# EAGLE schematic ee40_robot_final_p1 (EAGLE 6.5.0)
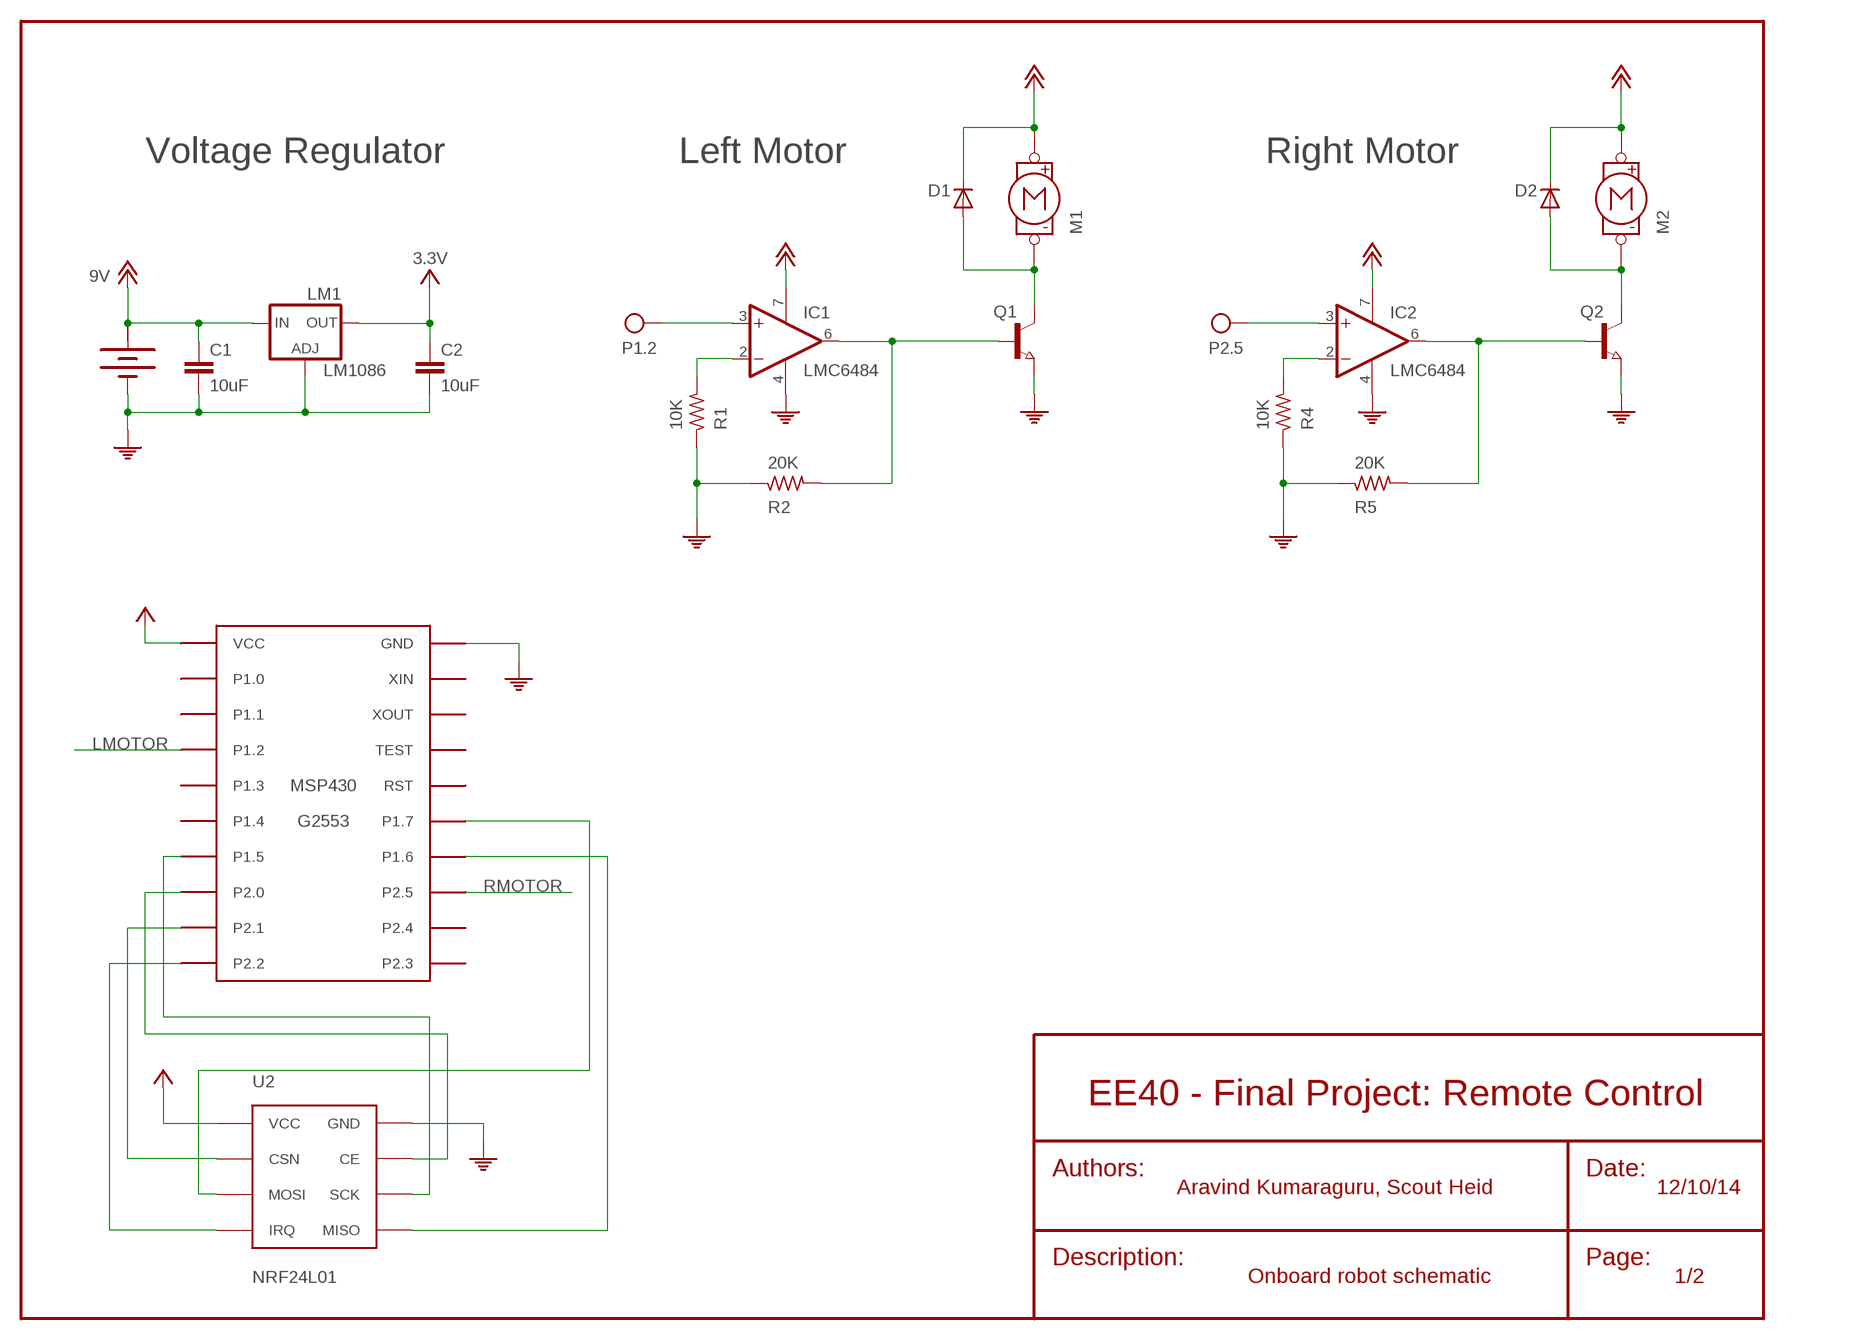
[diagram p0: schematic, sheet 1]

## Parts
BAT1  9V D-CELL  BATTERY  [BATTERY]
C1  10uF  C5/2.5  [C5B2.5]
C2  10uF  C5/2.5  [C5B2.5]
D1  1N4446  [DO35-10]
D2  1N4446  [DO35-10]
IC1  LMC6484  OPA344P  [DIL08]
IC2  LMC6484  OPA344P  [DIL08]
LM1  LM1086  LM138-TL  [TO220L1]
M1  MOTOR  [MOTOR]
M2  MOTOR  [MOTOR]
Q1  NPN-TRANSISTOR_SOT23  [SOT23]
Q2  NPN-TRANSISTOR_SOT23  [SOT23]
R1  10K  R-US_0204/7  [0204/7]
R2  20K  R-US_0204/7  [0204/7]
R4  10K  R-US_0204/7  [0204/7]
R5  20K  R-US_0204/7  [0204/7]
U1  MSP430  [MSP430]
U2  NRF24L01  [NRF24L01]

## Nets
9V: BAT1.+ C1.1 D1.C D2.C IC1.7(V+) IC2.7(V+) LM1.3(IN) M1.P$1(+) M2.P$1(+) ; supply symbol labelled +12V
CE: U1.P$8(P2.0) U2.P$1(CE)
CSN: U1.P$9(P2.1) U2.P$2(CSN)
GND: BAT1.- C1.2 C2.2 IC1.4(V-) IC2.4(V-) LM1.1(ADJ) Q1.2(E) Q2.2(E) R1.1 R2.1 R4.1 R5.1 U1.P$20(GND) U2.P$3(GND) ; supply symbol labelled PE
IRQ: U1.P$10(P2.2) U2.P$4(IRQ)
LMOTOR: IC1.3(+IN) U1.P$4(P1.2) ; supply symbol labelled P1.2
MISO: U1.P$14(P1.6) U2.P$5(MISO)
MOSI: U1.P$15(P1.7) U2.P$6(MOSI)
N$1: D2.A M2.P$2(-) Q2.3(C)
N$2: D1.A M1.P$2(-) Q1.3(C)
N$5: IC1.2(-IN) R1.2
N$6: IC2.2(-IN) R4.2
R1: IC2.6(OUT) Q2.1(B) R5.2
R2: IC1.6(OUT) Q1.1(B) R2.2
RMOTOR: IC2.3(+IN) U1.P$13(P2.5) ; supply symbol labelled P2.5
SCK: U1.P$7(P1.5) U2.P$7(SCK)
VCC: C2.1 LM1.2(OUT) U1.P$1(VCC) U2.P$8(VCC) ; supply symbol labelled 3.3V
Unconnected: U1.P$2(P1.0) U1.P$3(P1.1) U1.P$5(P1.3) U1.P$6(P1.4) U1.P$11(P2.3) U1.P$12(P2.4) U1.P$16(RST) U1.P$17(TEST) U1.P$18(XOUT) U1.P$19(XIN)

## Notes on the sheet
- Voltage Regulator | Left Motor | Right Motor
- EE40 - Final Project: Remote Control
- Authors: | Date:
- Aravind Kumaraguru, Scout Heid | 12/10/14
- Description: | Page:
- Onboard robot schematic | 1/2

## Power pins joined to a net without a drawn wire
+: BAT1.+@1(+)

## Library data of the parts
BAT1 = special:BATTERY: BATTERY
C1 C2 = capacitor-wima:C: CAPACITOR naming: grid - package width
D1 D2 = diode:1N4446: DIODE high speed (Philips)
IC1 IC2 = linear:OPA*: Single Operational Amplifier Low Power, Single-Supply, Rail-To-Rail Operational Amplifier Source: http://focus.ti.com/lit/ds/symlink/opa2345.pdf
LM1 = v-reg:LM138-TL: VOLTAGE REGULATOR
M1 M2 = ee40_robot:MOTOR: 9V DC Brushed Motor
Q1 Q2 = semicon-smd-ipc:NPN-TRANSISTOR_: NPN TRANSISTOR
R1 R2 R4 R5 = pie:R-US_: RESISTOR, American symbol; PIE-INT-REF-NUM: RESISTOR-GENERIC
U1 = ee40_robot:MSP430: MSP430-G2553 Microcontroller PinOuts
U2 = ee40_robot:NRF24L01